# EAGLE design 6M4HzClock (EAGLE 6.6.0)
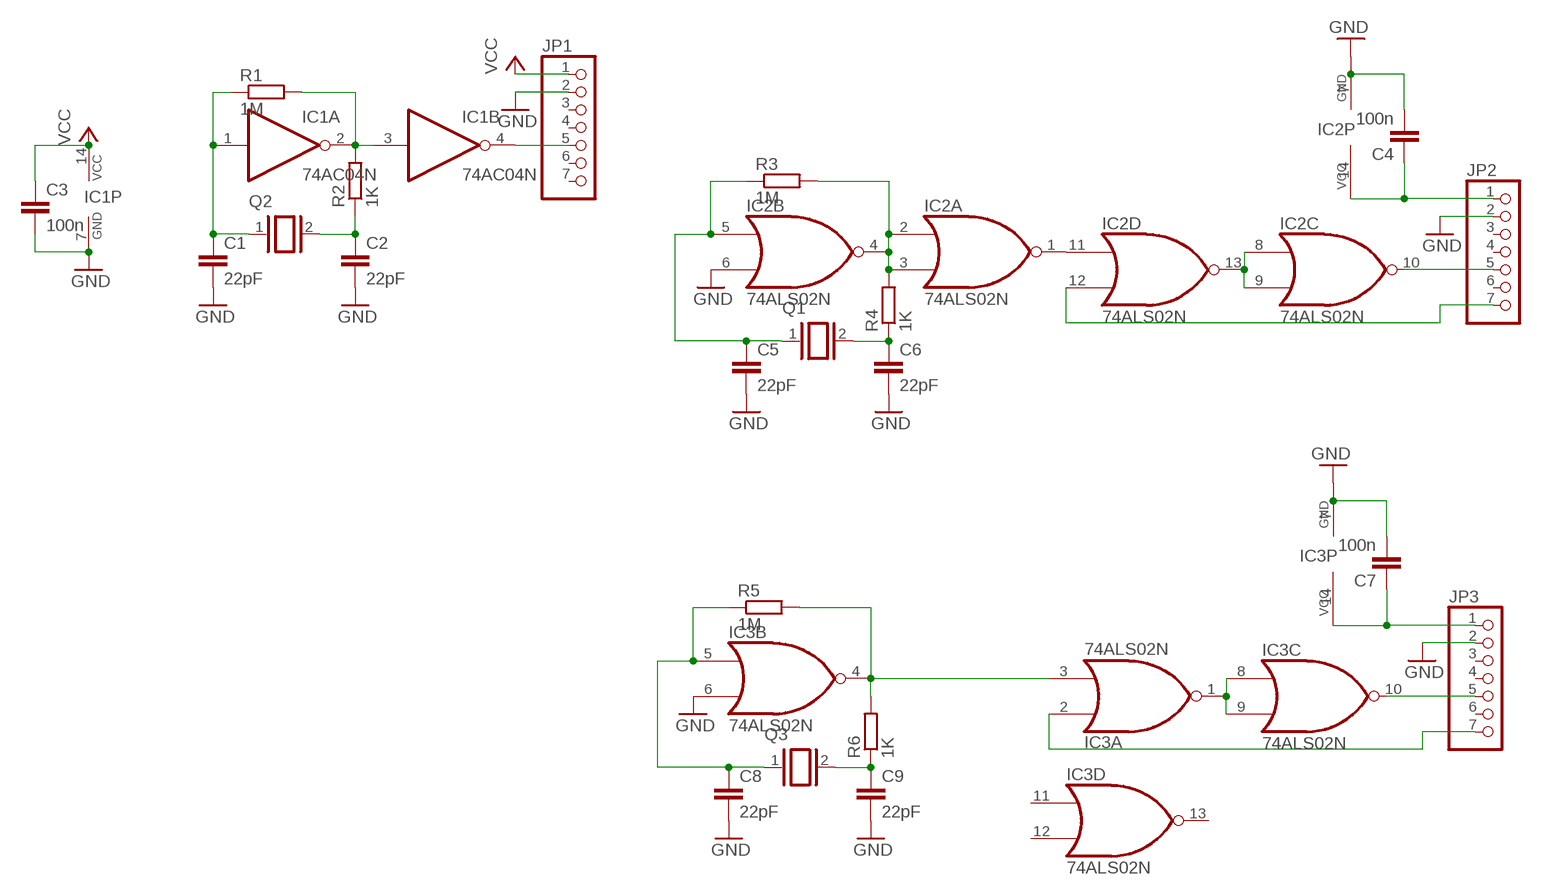
[diagram p0: schematic, sheet 1]

## Parts
C1  22pF  C-EU025-024X044  [C025-024X044]
C2  22pF  C-EU025-024X044  [C025-024X044]
C3  100n  C-EU050-024X044  [C050-024X044]
C4  100n  C-EU050-024X044  [C050-024X044]
C5  22pF  C-EU025-024X044  [C025-024X044]
C6  22pF  C-EU025-024X044  [C025-024X044]
C7  100n  C-EU050-024X044  [C050-024X044]
C8  22pF  C-EU025-024X044  [C025-024X044]
C9  22pF  C-EU025-024X044  [C025-024X044]
IC1  74AC04N  [DIL14]
IC2  74ALS02N  [DIL14]
IC3  74ALS02N  [DIL14]
JP1  PINHD-1X7  [1X07]
JP2  PINHD-1X7  [1X07]
JP3  PINHD-1X7  [1X07]
Q1  XTAL/S  [QS]
Q2  XTAL/S  [QS]
Q3  XTAL/S  [QS]
R1  1M  R-EU_0204/2V  [0204V]
R2  1K  R-EU_0204/2V  [0204V]
R3  1M  R-EU_0204/2V  [0204V]
R4  1K  R-EU_0204/2V  [0204V]
R5  1M  R-EU_0204/2V  [0204V]
R6  1K  R-EU_0204/2V  [0204V]

## Nets
6.4MHZ: IC1.4(B:O) JP1.5
6.4MHZ/02: IC2.1(A:O) IC2.11(D:I0)
6.4MHZ/OUT: IC2.10(C:O) JP2.5
6.4MHZ/OUT1: IC3.10(C:O) JP3.5
ENN: IC2.12(D:I1) JP2.7
ENN1: IC3.2(A:I0) JP3.7
GND: C1.2 C2.2 C3.2 C5.2 C6.2 C8.2 C9.2 IC1.7(P:GND) IC2.6(B:I1) IC2.7(P:GND) IC3.6(B:I1) IC3.7(P:GND) JP1.2 JP2.2 JP3.2
N$1: C1.1 IC1.1(A:I) Q2.1 R1.1
N$2: IC1.2(A:O) IC1.3(B:I) R1.2 R2.2
N$3: C2.1 Q2.2 R2.1
N$4: IC2.2(A:I0) IC2.3(A:I1) IC2.4(B:O) R3.2 R4.2
N$5: IC2.8(C:I0) IC2.9(C:I1) IC2.13(D:O)
N$6: C4.2
N$7: IC3.3(A:I1) IC3.4(B:O) R5.2 R6.2
N$8: C5.1 IC2.5(B:I0) Q1.1 R3.1
N$9: C6.1 Q1.2 R4.1
N$10: C7.2
N$11: C8.1 IC3.5(B:I0) Q3.1 R5.1
N$12: C9.1 Q3.2 R6.1
N$13: IC3.1(A:O) IC3.8(C:I0) IC3.9(C:I1)
VCC: C3.1 IC1.14(P:VCC) JP1.1
VCC/01: C7.1 IC3.14(P:VCC) JP3.1
VCC/02: C4.1 IC2.14(P:VCC) JP2.1
Unconnected: IC1.5(C:I) IC1.6(C:O) IC1.8(D:O) IC1.9(D:I) IC1.10(E:O) IC1.11(E:I) IC1.12(F:O) IC1.13(F:I) IC3.11(D:I0) IC3.12(D:I1) IC3.13(D:O) JP1.3 JP1.4 JP1.6 JP1.7 JP2.3 JP2.4 JP2.6 JP3.3 JP3.4 JP3.6

## Library data of the parts
C1-C9 = rcl:C-EU: CAPACITOR, European symbol
IC1 = 74xx-eu:74*04: Hex INVERTER
IC2 IC3 = 74xx-us:74*02: Quad 2-input NOR gate
JP1-JP3 = pinhead:PINHD-1X7: PIN HEADER
Q1-Q3 = special:XTAL/S: CRYSTAL
R1-R6 = rcl:R-EU_: RESISTOR, European symbol

## Board
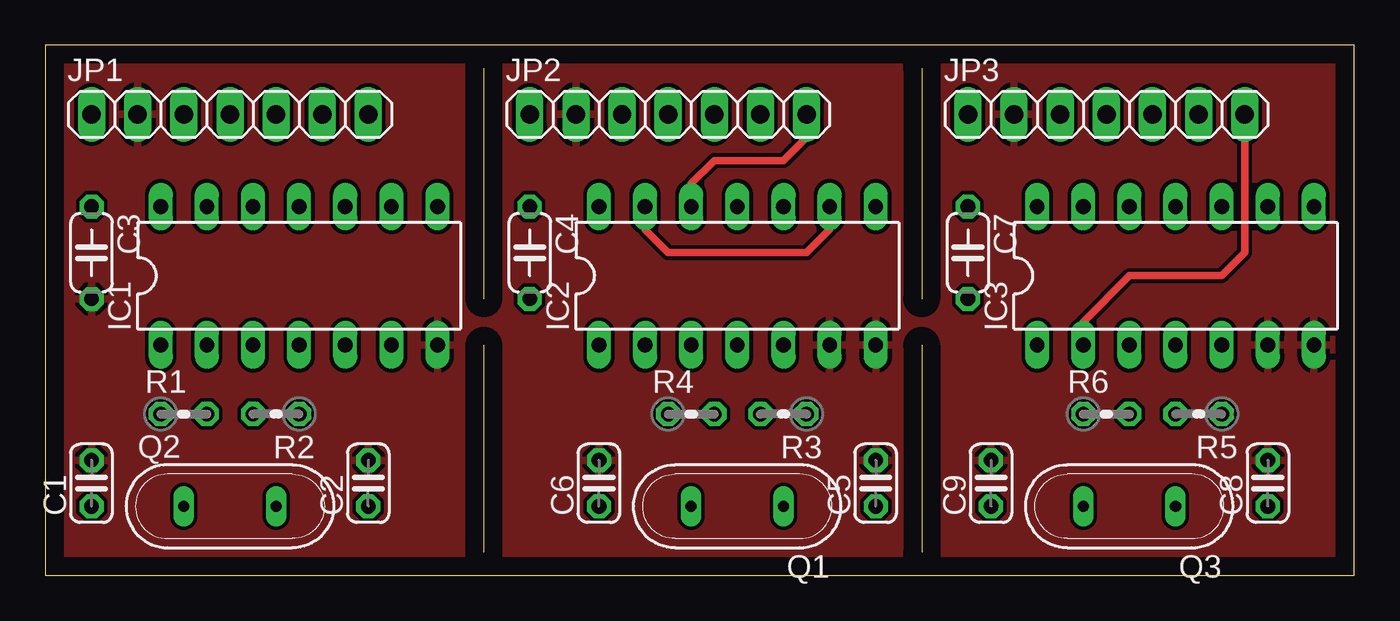
[diagram p1: board, top side]
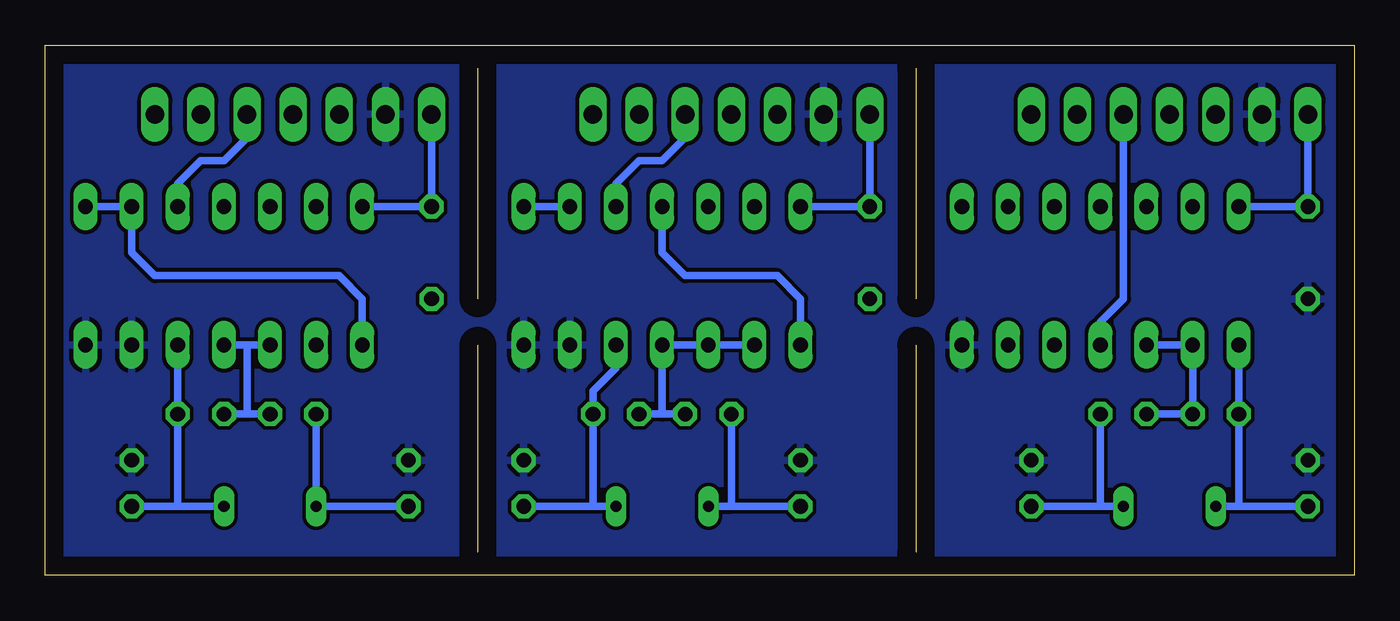
[diagram p2: board, bottom side, seen from below]

Size 72.06 x 29.2 mm. Coordinates in mm from the lower left corner, seen from the top.
Outline: 24.13,27.93 24.13,15.24
Outline: 24.13,12.69 24.13,1.27
Outline: 48.26,27.93 48.26,15.24
Outline: 48.26,12.69 48.26,1.27
Outline: 0,0 72.06,0 72.06,29.2 0,29.2 0,0
Copper layers (1*16): Top 0.035mm / dielectric 1.5mm / Bottom 0.035mm
Design rules "default": minimum track width 10mil, minimum drill 24mil, track to track 8mil, track to pad 8mil, pad to pad 8mil, via to via 8mil, smd to smd 8mil, copper to edge 40mil, drill to drill 8mil, minimum pad ring 10mil, minimum via ring 8mil, stop-mask expansion 4mil, vias tented up to drill 0mil, thermal gap 10mil

### Footprints (pad centres in the part's own frame; a part is rotated, then mirrored left to right if it is on the bottom)
C025-024X044 = drill 0.813 octagon: 1 -1.27,0; 2 1.27,0
C050-024X044 = drill 0.813 octagon: 1 -2.54,0; 2 2.54,0
DIL14 = drill 0.813 long: 1 -7.62,-3.81; 2 -5.08,-3.81; 3 -2.54,-3.81; 4 0,-3.81; 5 2.54,-3.81; 6 5.08,-3.81; 7 7.62,-3.81; 8 7.62,3.81; 9 5.08,3.81; 10 2.54,3.81; 11 0,3.81; 12 -2.54,3.81; 13 -5.08,3.81; 14 -7.62,3.81
1X07 = drill 1.016 long: 1 -7.62,0; 2 -5.08,0; 3 -2.54,0; 4 0,0; 5 2.54,0; 6 5.08,0; 7 7.62,0
QS = drill 0.61 long: 1 -2.54,0; 2 2.54,0
0204V = drill 0.813 octagon: 1 -1.27,0; 2 1.27,0

### Placement (x,y rotation side)
C1  2.54,5.08 90 top
C2  17.78,5.08 90 top
C3  2.54,17.78 270 top
C4  26.67,17.78 270 top
C5  45.72,5.08 90 top
C6  30.48,5.08 90 top
C7  50.8,17.78 270 top
C8  67.31,5.08 90 top
C9  52.07,5.08 90 top
IC1  13.97,16.51 0 top
IC2  38.1,16.51 0 top
IC3  62.23,16.51 0 top
JP1  10.16,25.4 0 top
JP2  34.29,25.4 0 top
JP3  58.42,25.4 0 top
Q1  38.1,3.81 180 top
Q2  10.16,3.81 0 top
Q3  59.69,3.81 180 top
R1  7.62,8.89 0 top
R2  12.7,8.89 180 top
R3  40.64,8.89 180 top
R4  35.56,8.89 0 top
R5  63.5,8.89 180 top
R6  58.42,8.89 0 top

### Tracks (layer width: path | path; a pad name or v marks a point on that pad's centre or on a via)
6.4MHZ
  Bottom 0.406: IC1.4 13.97,13.97 12.7,15.24 JP1.5
6.4MHZ/02
  Bottom 0.406: IC2.1 30.48,15.24 31.75,16.51 36.83,16.51 38.1,17.78 IC2.11
6.4MHZ/OUT
  Bottom 0.406: JP2.5 36.83,24.13 38.1,22.86 39.37,22.86 40.64,21.59 IC2.10
6.4MHZ/OUT1
  Bottom 0.406: IC3.10 64.77,21.59 63.5,22.86 62.23,22.86 60.96,24.13 JP3.5
ENN
  Top 0.406: JP2.7 41.91,24.13 40.64,22.86 36.83,22.86 35.56,21.59 IC2.12
ENN1
  Top 0.406: IC3.2 57.15,13.97 59.69,16.51 64.77,16.51 66.04,17.78 JP3.7
GND
  pour Bottom: 0,0 72.39,0 72.39,29.21 0,29.21
  pour Top: 0,0 72.39,0 72.39,29.21 0,29.21
N$1
  Bottom 0.406: IC1.1 R1.1 6.35,3.81 | C1.1 6.35,3.81 | 6.35,3.81 Q2.1
N$2
  Bottom 0.406: IC1.3 IC1.2 R1.2 R2.2
N$3
  Bottom 0.406: 13.97,3.81 R2.1 | C2.1 13.97,3.81 | 13.97,3.81 Q2.2
N$4
  Bottom 0.406: IC2.2 IC2.3 IC2.4 38.1,8.89 | 38.1,8.89 R3.2 | R4.2 38.1,8.89
N$5
  Top 0.406: IC2.13 33.02,19.05 34.29,17.78 41.91,17.78 43.18,19.05 IC2.9
  Bottom 0.406: IC2.8 IC2.9
N$7
  Bottom 0.406: IC3.3 60.96,12.7 | 60.96,12.7 IC3.4 | R5.2 60.96,8.89 | R6.2 60.96,8.89 | 60.96,8.89 60.96,12.7
N$8
  Bottom 0.406: 41.91,3.81 C5.1 | Q1.1 41.91,3.81 | 41.91,3.81 R3.1 41.91,10.16 40.64,11.43 IC2.5
N$9
  Bottom 0.406: C6.1 34.29,3.81 | Q1.2 34.29,3.81 | 34.29,3.81 R4.1
N$11
  Bottom 0.406: 64.77,3.81 C8.1 | Q3.1 64.77,3.81 | 64.77,3.81 R5.1 IC3.5
N$12
  Bottom 0.406: C9.1 Q3.2 R6.1
N$13
  Bottom 0.406: IC3.8 IC3.9 67.31,17.78 66.04,16.51 55.88,16.51 54.61,15.24 IC3.1
VCC
  Bottom 0.406: JP1.1 C3.1 IC1.14
VCC/01
  Bottom 0.406: IC3.14 C7.1 JP3.1
VCC/02
  Bottom 0.406: JP2.1 C4.1 IC2.14